# Altium schematic sheet Mosquito2.SchDoc
size A4
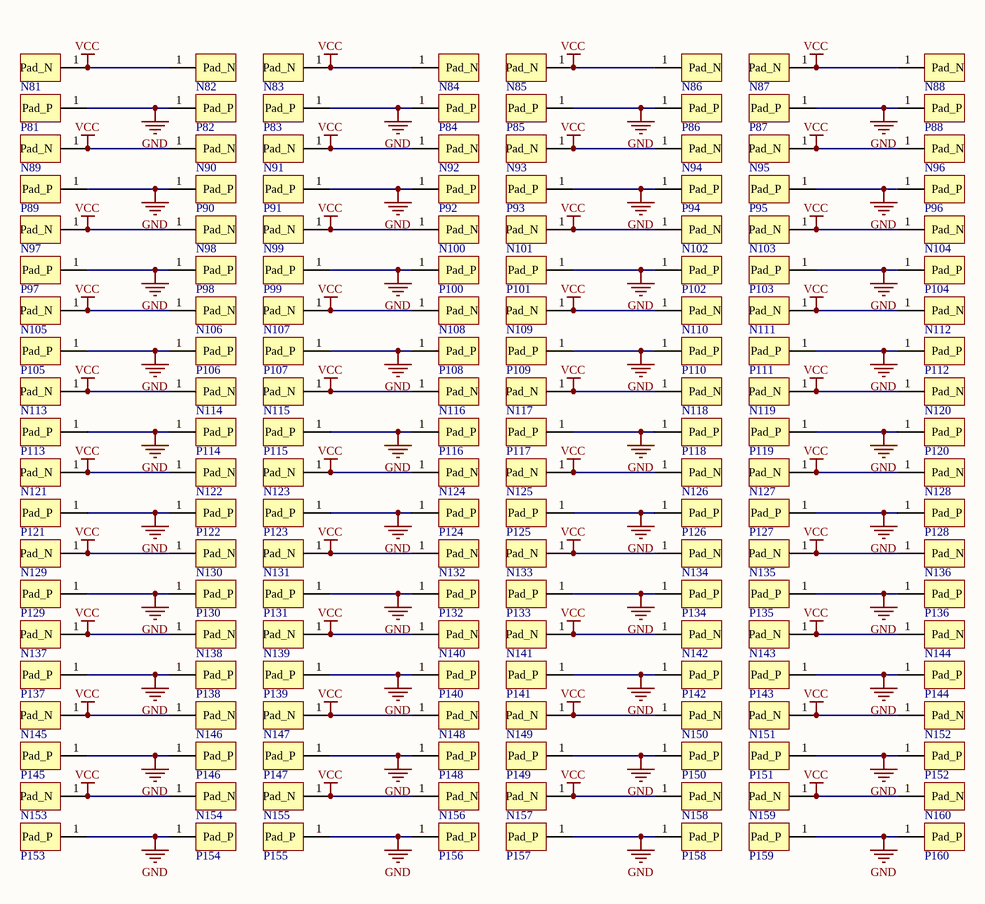
[diagram p0: Mosquito2.SchDoc]

## Parts
N81  Pad_N  [Pad]  (value not drawn)
N82  Pad_N  [Pad]  (value not drawn)
N83  Pad_N  [Pad]  (value not drawn)
N84  Pad_N  [Pad]  (value not drawn)
N85  Pad_N  [Pad]  (value not drawn)
N86  Pad_N  [Pad]  (value not drawn)
N87  Pad_N  [Pad]  (value not drawn)
N88  Pad_N  [Pad]  (value not drawn)
N89  Pad_N  [Pad]  (value not drawn)
N90  Pad_N  [Pad]  (value not drawn)
N91  Pad_N  [Pad]  (value not drawn)
N92  Pad_N  [Pad]  (value not drawn)
N93  Pad_N  [Pad]  (value not drawn)
N94  Pad_N  [Pad]  (value not drawn)
N95  Pad_N  [Pad]  (value not drawn)
N96  Pad_N  [Pad]  (value not drawn)
N97  Pad_N  [Pad]  (value not drawn)
N98  Pad_N  [Pad]  (value not drawn)
N99  Pad_N  [Pad]  (value not drawn)
N100  Pad_N  [Pad]  (value not drawn)
N101  Pad_N  [Pad]  (value not drawn)
N102  Pad_N  [Pad]  (value not drawn)
N103  Pad_N  [Pad]  (value not drawn)
N104  Pad_N  [Pad]  (value not drawn)
N105  Pad_N  [Pad]  (value not drawn)
N106  Pad_N  [Pad]  (value not drawn)
N107  Pad_N  [Pad]  (value not drawn)
N108  Pad_N  [Pad]  (value not drawn)
N109  Pad_N  [Pad]  (value not drawn)
N110  Pad_N  [Pad]  (value not drawn)
N111  Pad_N  [Pad]  (value not drawn)
N112  Pad_N  [Pad]  (value not drawn)
N113  Pad_N  [Pad]  (value not drawn)
N114  Pad_N  [Pad]  (value not drawn)
N115  Pad_N  [Pad]  (value not drawn)
N116  Pad_N  [Pad]  (value not drawn)
N117  Pad_N  [Pad]  (value not drawn)
N118  Pad_N  [Pad]  (value not drawn)
N119  Pad_N  [Pad]  (value not drawn)
N120  Pad_N  [Pad]  (value not drawn)
N121  Pad_N  [Pad]  (value not drawn)
N122  Pad_N  [Pad]  (value not drawn)
N123  Pad_N  [Pad]  (value not drawn)
N124  Pad_N  [Pad]  (value not drawn)
N125  Pad_N  [Pad]  (value not drawn)
N126  Pad_N  [Pad]  (value not drawn)
N127  Pad_N  [Pad]  (value not drawn)
N128  Pad_N  [Pad]  (value not drawn)
N129  Pad_N  [Pad]  (value not drawn)
N130  Pad_N  [Pad]  (value not drawn)
N131  Pad_N  [Pad]  (value not drawn)
N132  Pad_N  [Pad]  (value not drawn)
N133  Pad_N  [Pad]  (value not drawn)
N134  Pad_N  [Pad]  (value not drawn)
N135  Pad_N  [Pad]  (value not drawn)
N136  Pad_N  [Pad]  (value not drawn)
N137  Pad_N  [Pad]  (value not drawn)
N138  Pad_N  [Pad]  (value not drawn)
N139  Pad_N  [Pad]  (value not drawn)
N140  Pad_N  [Pad]  (value not drawn)
N141  Pad_N  [Pad]  (value not drawn)
N142  Pad_N  [Pad]  (value not drawn)
N143  Pad_N  [Pad]  (value not drawn)
N144  Pad_N  [Pad]  (value not drawn)
N145  Pad_N  [Pad]  (value not drawn)
N146  Pad_N  [Pad]  (value not drawn)
N147  Pad_N  [Pad]  (value not drawn)
N148  Pad_N  [Pad]  (value not drawn)
N149  Pad_N  [Pad]  (value not drawn)
N150  Pad_N  [Pad]  (value not drawn)
N151  Pad_N  [Pad]  (value not drawn)
N152  Pad_N  [Pad]  (value not drawn)
N153  Pad_N  [Pad]  (value not drawn)
N154  Pad_N  [Pad]  (value not drawn)
N155  Pad_N  [Pad]  (value not drawn)
N156  Pad_N  [Pad]  (value not drawn)
N157  Pad_N  [Pad]  (value not drawn)
N158  Pad_N  [Pad]  (value not drawn)
N159  Pad_N  [Pad]  (value not drawn)
N160  Pad_N  [Pad]  (value not drawn)
P81  Pad_P  [Pad]  (value not drawn)
P82  Pad_P  [Pad]  (value not drawn)
P83  Pad_P  [Pad]  (value not drawn)
P84  Pad_P  [Pad]  (value not drawn)
P85  Pad_P  [Pad]  (value not drawn)
P86  Pad_P  [Pad]  (value not drawn)
P87  Pad_P  [Pad]  (value not drawn)
P88  Pad_P  [Pad]  (value not drawn)
P89  Pad_P  [Pad]  (value not drawn)
P90  Pad_P  [Pad]  (value not drawn)
P91  Pad_P  [Pad]  (value not drawn)
P92  Pad_P  [Pad]  (value not drawn)
P93  Pad_P  [Pad]  (value not drawn)
P94  Pad_P  [Pad]  (value not drawn)
P95  Pad_P  [Pad]  (value not drawn)
P96  Pad_P  [Pad]  (value not drawn)
P97  Pad_P  [Pad]  (value not drawn)
P98  Pad_P  [Pad]  (value not drawn)
P99  Pad_P  [Pad]  (value not drawn)
P100  Pad_P  [Pad]  (value not drawn)
P101  Pad_P  [Pad]  (value not drawn)
P102  Pad_P  [Pad]  (value not drawn)
P103  Pad_P  [Pad]  (value not drawn)
P104  Pad_P  [Pad]  (value not drawn)
P105  Pad_P  [Pad]  (value not drawn)
P106  Pad_P  [Pad]  (value not drawn)
P107  Pad_P  [Pad]  (value not drawn)
P108  Pad_P  [Pad]  (value not drawn)
P109  Pad_P  [Pad]  (value not drawn)
P110  Pad_P  [Pad]  (value not drawn)
P111  Pad_P  [Pad]  (value not drawn)
P112  Pad_P  [Pad]  (value not drawn)
P113  Pad_P  [Pad]  (value not drawn)
P114  Pad_P  [Pad]  (value not drawn)
P115  Pad_P  [Pad]  (value not drawn)
P116  Pad_P  [Pad]  (value not drawn)
P117  Pad_P  [Pad]  (value not drawn)
P118  Pad_P  [Pad]  (value not drawn)
P119  Pad_P  [Pad]  (value not drawn)
P120  Pad_P  [Pad]  (value not drawn)
P121  Pad_P  [Pad]  (value not drawn)
P122  Pad_P  [Pad]  (value not drawn)
P123  Pad_P  [Pad]  (value not drawn)
P124  Pad_P  [Pad]  (value not drawn)
P125  Pad_P  [Pad]  (value not drawn)
P126  Pad_P  [Pad]  (value not drawn)
P127  Pad_P  [Pad]  (value not drawn)
P128  Pad_P  [Pad]  (value not drawn)
P129  Pad_P  [Pad]  (value not drawn)
P130  Pad_P  [Pad]  (value not drawn)
P131  Pad_P  [Pad]  (value not drawn)
P132  Pad_P  [Pad]  (value not drawn)
P133  Pad_P  [Pad]  (value not drawn)
P134  Pad_P  [Pad]  (value not drawn)
P135  Pad_P  [Pad]  (value not drawn)
P136  Pad_P  [Pad]  (value not drawn)
P137  Pad_P  [Pad]  (value not drawn)
P138  Pad_P  [Pad]  (value not drawn)
P139  Pad_P  [Pad]  (value not drawn)
P140  Pad_P  [Pad]  (value not drawn)
P141  Pad_P  [Pad]  (value not drawn)
P142  Pad_P  [Pad]  (value not drawn)
P143  Pad_P  [Pad]  (value not drawn)
P144  Pad_P  [Pad]  (value not drawn)
P145  Pad_P  [Pad]  (value not drawn)
P146  Pad_P  [Pad]  (value not drawn)
P147  Pad_P  [Pad]  (value not drawn)
P148  Pad_P  [Pad]  (value not drawn)
P149  Pad_P  [Pad]  (value not drawn)
P150  Pad_P  [Pad]  (value not drawn)
P151  Pad_P  [Pad]  (value not drawn)
P152  Pad_P  [Pad]  (value not drawn)
P153  Pad_P  [Pad]  (value not drawn)
P154  Pad_P  [Pad]  (value not drawn)
P155  Pad_P  [Pad]  (value not drawn)
P156  Pad_P  [Pad]  (value not drawn)
P157  Pad_P  [Pad]  (value not drawn)
P158  Pad_P  [Pad]  (value not drawn)
P159  Pad_P  [Pad]  (value not drawn)
P160  Pad_P  [Pad]  (value not drawn)

## Nets
GND: P81.1(Pad_P) P82.1(Pad_P) P83.1(Pad_P) P84.1(Pad_P) P85.1(Pad_P) P86.1(Pad_P) P87.1(Pad_P) P88.1(Pad_P) P89.1(Pad_P) P90.1(Pad_P) P91.1(Pad_P) P92.1(Pad_P) P93.1(Pad_P) P94.1(Pad_P) P95.1(Pad_P) P96.1(Pad_P) P97.1(Pad_P) P98.1(Pad_P) P99.1(Pad_P) P100.1(Pad_P) P101.1(Pad_P) P102.1(Pad_P) P103.1(Pad_P) P104.1(Pad_P) P105.1(Pad_P) P106.1(Pad_P) P107.1(Pad_P) P108.1(Pad_P) P109.1(Pad_P) P110.1(Pad_P) P111.1(Pad_P) P112.1(Pad_P) P113.1(Pad_P) P114.1(Pad_P) P115.1(Pad_P) P116.1(Pad_P) P117.1(Pad_P) P118.1(Pad_P) P119.1(Pad_P) P120.1(Pad_P) P121.1(Pad_P) P122.1(Pad_P) P123.1(Pad_P) P124.1(Pad_P) P125.1(Pad_P) P126.1(Pad_P) P127.1(Pad_P) P128.1(Pad_P) P129.1(Pad_P) P130.1(Pad_P) P131.1(Pad_P) P132.1(Pad_P) P133.1(Pad_P) P134.1(Pad_P) P135.1(Pad_P) P136.1(Pad_P) P137.1(Pad_P) P138.1(Pad_P) P139.1(Pad_P) P140.1(Pad_P) P141.1(Pad_P) P142.1(Pad_P) P143.1(Pad_P) P144.1(Pad_P) P145.1(Pad_P) P146.1(Pad_P) P147.1(Pad_P) P148.1(Pad_P) P149.1(Pad_P) P150.1(Pad_P) P151.1(Pad_P) P152.1(Pad_P) P153.1(Pad_P) P154.1(Pad_P) P155.1(Pad_P) P156.1(Pad_P) P157.1(Pad_P) P158.1(Pad_P) P159.1(Pad_P) P160.1(Pad_P)
VCC: N81.1(Pad_N) N82.1(Pad_N) N83.1(Pad_N) N84.1(Pad_N) N85.1(Pad_N) N86.1(Pad_N) N87.1(Pad_N) N88.1(Pad_N) N89.1(Pad_N) N90.1(Pad_N) N91.1(Pad_N) N92.1(Pad_N) N93.1(Pad_N) N94.1(Pad_N) N95.1(Pad_N) N96.1(Pad_N) N97.1(Pad_N) N98.1(Pad_N) N99.1(Pad_N) N100.1(Pad_N) N101.1(Pad_N) N102.1(Pad_N) N103.1(Pad_N) N104.1(Pad_N) N105.1(Pad_N) N106.1(Pad_N) N107.1(Pad_N) N108.1(Pad_N) N109.1(Pad_N) N110.1(Pad_N) N111.1(Pad_N) N112.1(Pad_N) N113.1(Pad_N) N114.1(Pad_N) N115.1(Pad_N) N116.1(Pad_N) N117.1(Pad_N) N118.1(Pad_N) N119.1(Pad_N) N120.1(Pad_N) N121.1(Pad_N) N122.1(Pad_N) N123.1(Pad_N) N124.1(Pad_N) N125.1(Pad_N) N126.1(Pad_N) N127.1(Pad_N) N128.1(Pad_N) N129.1(Pad_N) N130.1(Pad_N) N131.1(Pad_N) N132.1(Pad_N) N133.1(Pad_N) N134.1(Pad_N) N135.1(Pad_N) N136.1(Pad_N) N137.1(Pad_N) N138.1(Pad_N) N139.1(Pad_N) N140.1(Pad_N) N141.1(Pad_N) N142.1(Pad_N) N143.1(Pad_N) N144.1(Pad_N) N145.1(Pad_N) N146.1(Pad_N) N147.1(Pad_N) N148.1(Pad_N) N149.1(Pad_N) N150.1(Pad_N) N151.1(Pad_N) N152.1(Pad_N) N153.1(Pad_N) N154.1(Pad_N) N155.1(Pad_N) N156.1(Pad_N) N157.1(Pad_N) N158.1(Pad_N) N159.1(Pad_N) N160.1(Pad_N)